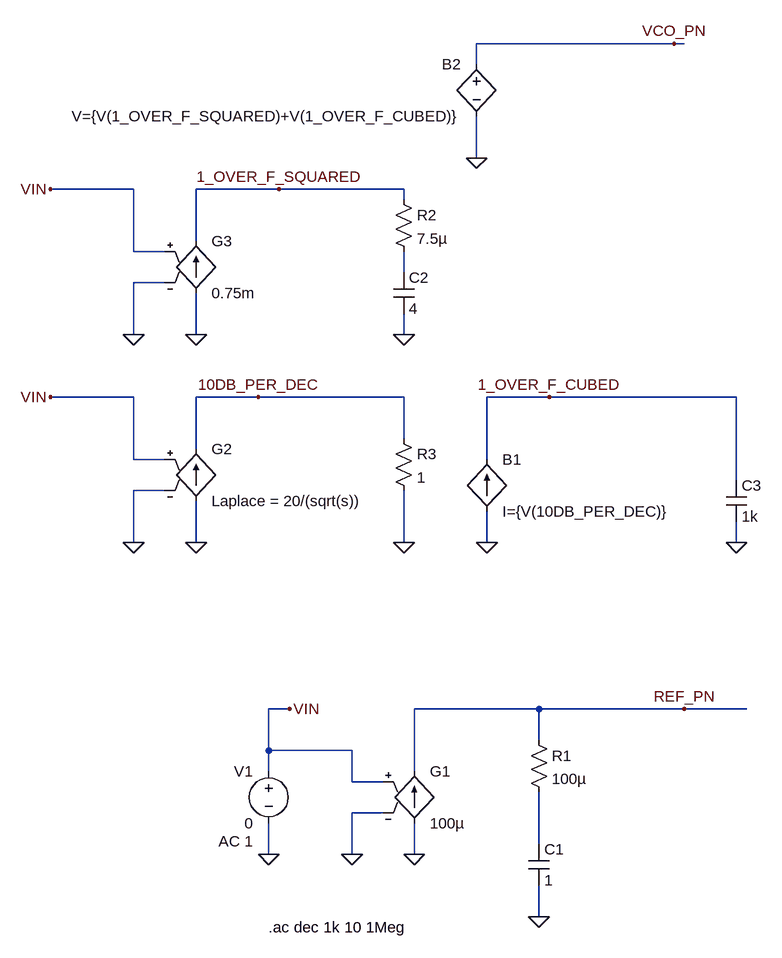
[diagram p0: schematic Example_ABLNO_100MHZ_VCXO_Phase_Noise.asc]
Example_ABLNO_100MHZ_VCXO_Phase_Noise.asc, the LTspice schematic file:
Version 4
SHEET 1 1288 680
WIRE 528 -1008 224 -1008
WIRE 544 -1008 528 -1008
WIRE 224 -976 224 -1008
WIRE 224 -832 224 -896
WIRE -304 -784 -432 -784
WIRE -80 -784 -208 -784
WIRE 112 -784 -80 -784
WIRE 112 -768 112 -784
WIRE -208 -704 -208 -784
WIRE -304 -688 -304 -784
WIRE -256 -688 -304 -688
WIRE 112 -656 112 -688
WIRE -256 -640 -304 -640
WIRE -304 -560 -304 -640
WIRE -208 -560 -208 -624
WIRE 112 -560 112 -592
WIRE -304 -464 -432 -464
WIRE -112 -464 -208 -464
WIRE 112 -464 -112 -464
WIRE 336 -464 240 -464
WIRE 624 -464 336 -464
WIRE 112 -400 112 -464
WIRE -208 -384 -208 -464
WIRE -304 -368 -304 -464
WIRE -256 -368 -304 -368
WIRE 240 -368 240 -464
WIRE 624 -336 624 -464
WIRE -256 -320 -304 -320
WIRE -304 -240 -304 -320
WIRE -208 -240 -208 -304
WIRE 112 -240 112 -320
WIRE 240 -240 240 -288
WIRE 624 -240 624 -272
WIRE -64 16 -96 16
WIRE 320 16 128 16
WIRE 544 16 320 16
WIRE 640 16 544 16
WIRE 320 64 320 16
WIRE -96 80 -96 16
WIRE 32 80 -96 80
WIRE -96 112 -96 80
WIRE 128 112 128 16
WIRE 32 128 32 80
WIRE 80 128 32 128
WIRE 80 176 32 176
WIRE 320 224 320 144
WIRE -96 240 -96 192
WIRE 32 240 32 176
WIRE 128 240 128 192
WIRE 320 336 320 288
FLAG 128 240 0
FLAG 32 240 0
FLAG -96 240 0
FLAG 320 336 0
FLAG -64 16 VIN
FLAG -208 -240 0
FLAG -304 -240 0
FLAG 112 -240 0
FLAG -432 -464 VIN
FLAG -112 -464 10DB_PER_DEC
FLAG 240 -240 0
FLAG 624 -240 0
FLAG 336 -464 1_OVER_F_CUBED
FLAG 544 16 REF_PN
FLAG -208 -560 0
FLAG -304 -560 0
FLAG 112 -560 0
FLAG -432 -784 VIN
FLAG -80 -784 1_OVER_F_SQUARED
FLAG 528 -1008 VCO_PN
FLAG 224 -832 0
SYMBOL g 128 96 R0
SYMATTR InstName G1
SYMATTR Value 100µ
SYMBOL voltage -96 96 M0
WINDOW 123 24 124 Left 2
WINDOW 39 0 0 Left 0
SYMATTR Value2 AC 1
SYMATTR InstName V1
SYMATTR Value 0
SYMBOL cap 304 224 R0
SYMATTR InstName C1
SYMATTR Value 1
SYMBOL res 304 48 R0
SYMATTR InstName R1
SYMATTR Value 100µ
SYMBOL g -208 -400 R0
SYMATTR InstName G2
SYMATTR Value Laplace = 20/(sqrt(s))
SYMBOL res 96 -416 R0
SYMATTR InstName R3
SYMATTR Value 1
SYMBOL bi 240 -288 M180
WINDOW 0 24 80 Left 2
WINDOW 3 24 0 Left 2
SYMATTR InstName B1
SYMATTR Value I={V(10DB_PER_DEC)}
SYMBOL cap 608 -336 R0
SYMATTR InstName C3
SYMATTR Value 1k
SYMBOL g -208 -720 R0
SYMATTR InstName G3
SYMATTR Value 0.75m
SYMBOL cap 96 -656 R0
SYMATTR InstName C2
SYMATTR Value 4
SYMBOL res 96 -784 R0
SYMATTR InstName R2
SYMATTR Value 7.5µ
SYMBOL bv 224 -992 M0
SYMATTR InstName B2
SYMATTR Value V={V(1_OVER_F_SQUARED)+V(1_OVER_F_CUBED)}
TEXT -96 352 Left 2 !.ac dec 1k 10 1Meg

The netlist it stands for:
* Example_ABLNO_100MHZ_VCXO_Phase_Noise.asc
G1 0 REF_PN VIN 0 100µ
V1 VIN 0 0 AC 1
C1 N002 0 1
R1 REF_PN N002 100µ
G2 0 10DB_PER_DEC VIN 0 Laplace = 20/(sqrt(s))
R3 10DB_PER_DEC 0 1
B1 0 1_OVER_F_CUBED I={V(10DB_PER_DEC)}
C3 1_OVER_F_CUBED 0 1k
G3 0 1_OVER_F_SQUARED VIN 0 0.75m
C2 N001 0 4
R2 1_OVER_F_SQUARED N001 7.5µ
B2 VCO_PN 0 V={V(1_OVER_F_SQUARED)+V(1_OVER_F_CUBED)}
.ac dec 1k 10 1Meg
.backanno
.end

* Results of the author's LTspice run, read from the files saved beside the schematic
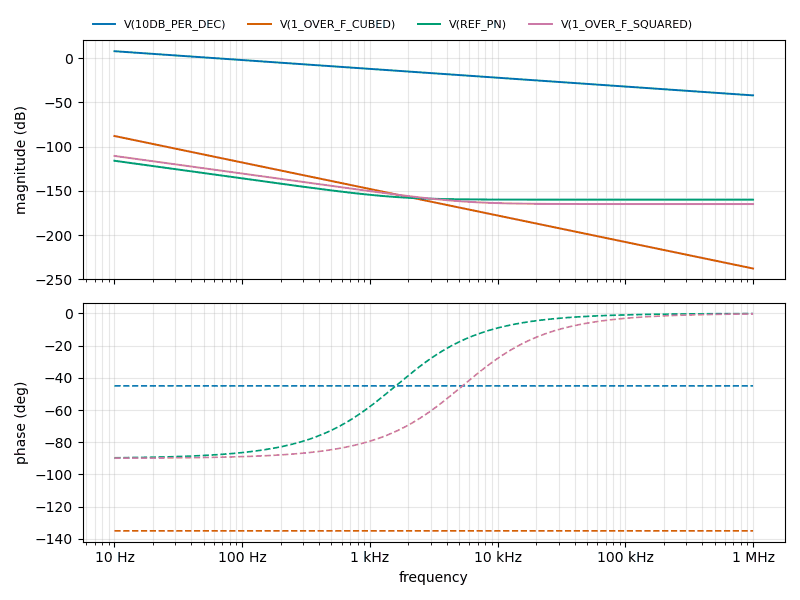
[diagram p1: AC Analysis of Example_ABLNO_100MHZ_VCXO_Phase_Noise.asc, plotted from the saved traces]
* AC Analysis, 1 run:
*   V(10DB_PER_DEC): 8.04 dB at 10 Hz, -41.96 dB at 1 MHz, peak 8.04 dB at 10 Hz, 3 dB below the peak at 20 Hz
*   V(1_OVER_F_CUBED): -87.92 dB at 10 Hz, -237.92 dB at 1 MHz, peak -87.92 dB at 10 Hz, 3 dB below the peak at 12.6 Hz
*   V(REF_PN): -115.96 dB at 10 Hz, -160.00 dB at 1 MHz, peak -115.96 dB at 10 Hz, 3 dB below the peak at 14.14 Hz
*   V(1_OVER_F_SQUARED): -110.50 dB at 10 Hz, -165.00 dB at 1 MHz, peak -110.50 dB at 10 Hz, 3 dB below the peak at 14.14 Hz